# EAGLE design pepper-8m (EAGLE 6.4)
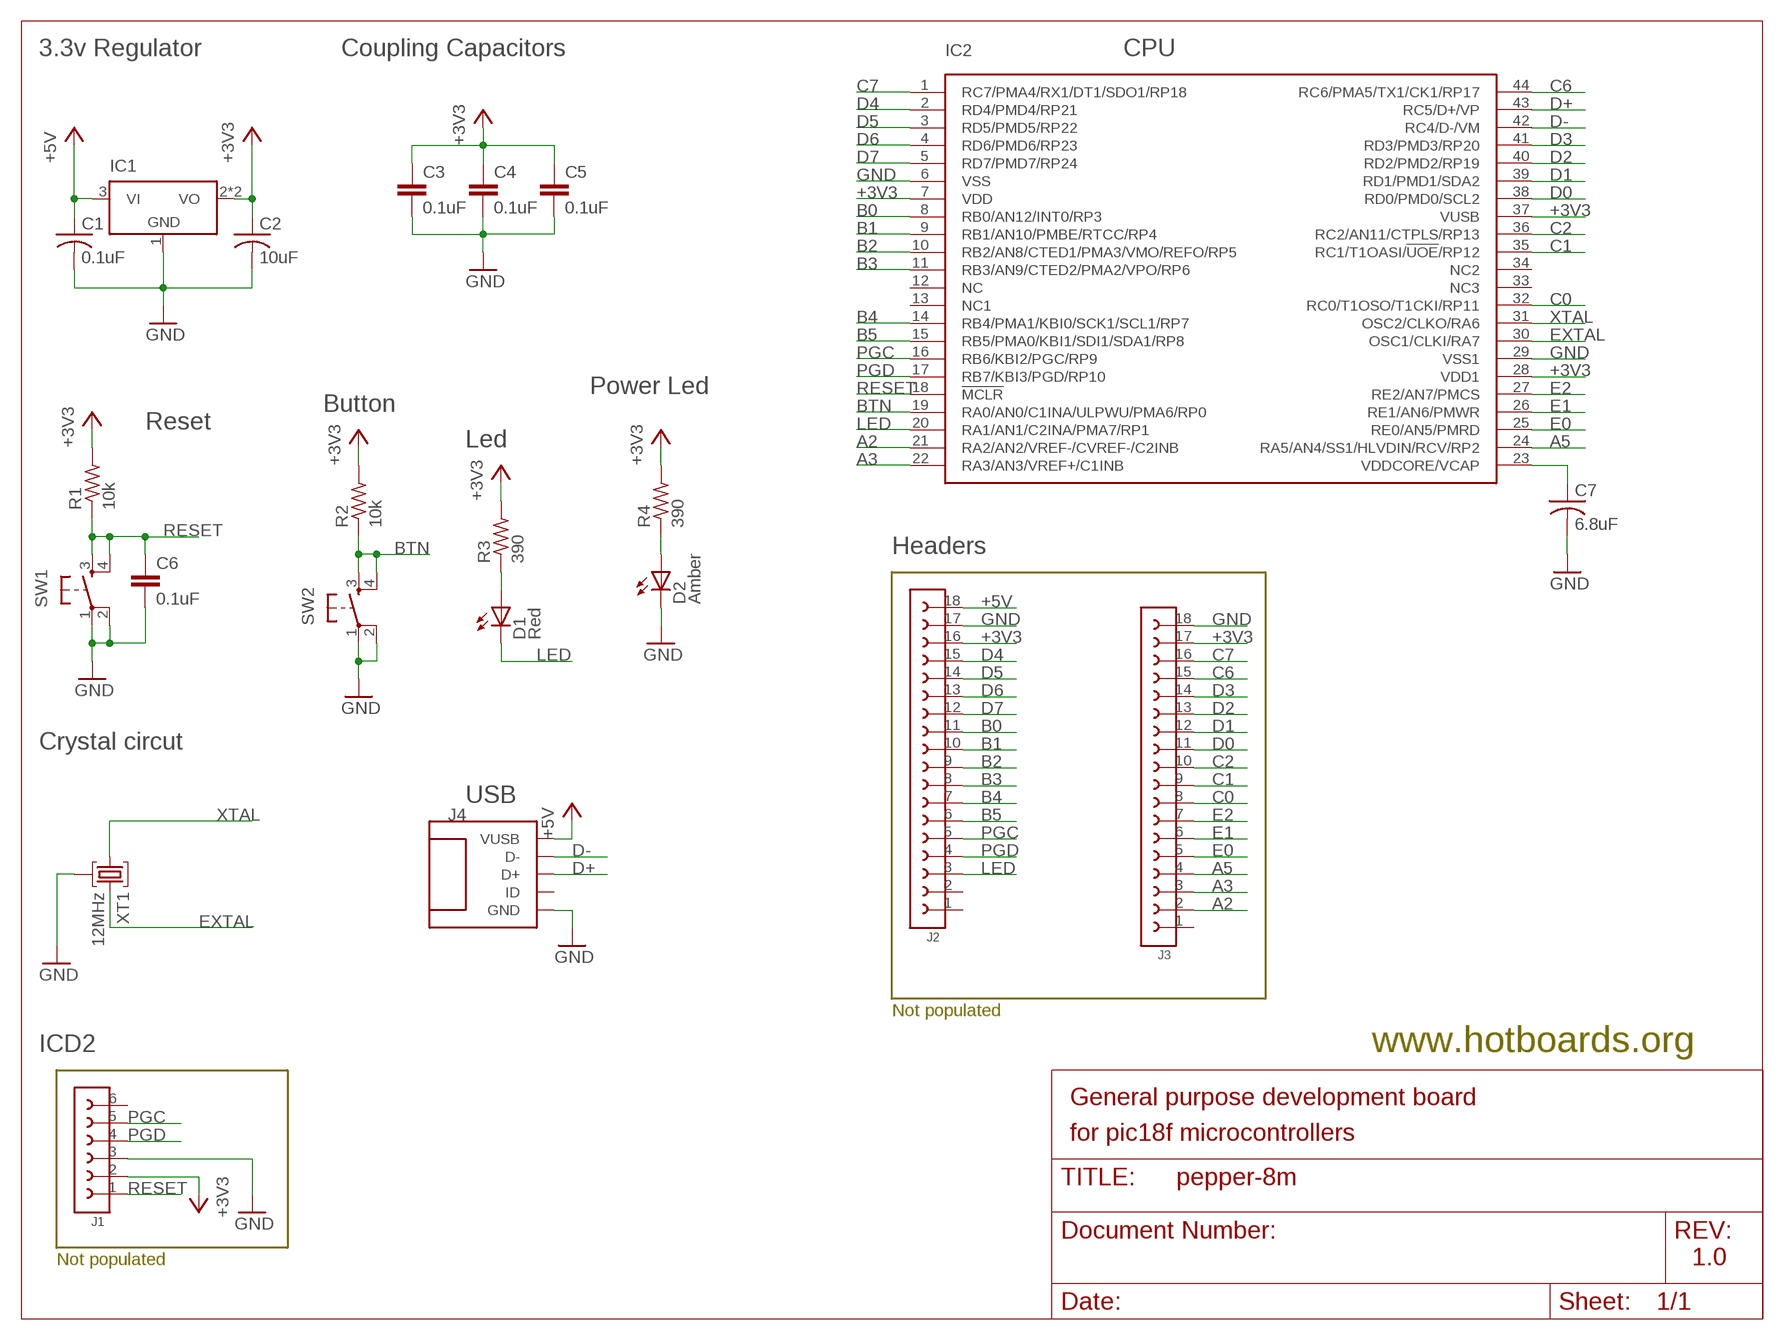
[diagram p0: schematic, sheet 1]

## Parts
C1  0.1uF  T491A104K050AT  [CAPMP3216-18]
C2  10uF  T491A106K016AT  [CAPMP3216-18]
C3  0.1uF  C0603C104Z3VAC  [CAPC0603]
C4  0.1uF  C0603C104Z3VAC  [CAPC0603]
C5  0.1uF  C0603C104Z3VAC  [CAPC0603]
C6  0.1uF  C0603C104Z3VAC  [CAPC0603]
C7  6.8uF  T491A685M006AT  [CAPMP3216-18]
D1  Red  SM0805AC  [D0805]
D2  Amber  SM0805HC  [D0805]
IC1  LD1117S33TR  [SOT230P700X180-4N]
IC2  PIC18F45J50-I/PT'  [TQFP80P1200X1200X100-44N]
J1  61300611121  [PHSP254P1524X254X1154-6S]
J2  61301811121  [PHSP254P4572X254X1154-18S]
J3  61301811121  [PHSP254P4572X254X1154-18S]
J4  -1734035-1  [USB-MINIB-SMD+SMD+RET]
R1  10k  CRG0603F10K10  [RESC0603]
R2  10k  CRG0603F10K10  [RESC0603]
R3  390  CRG0603F390R  [RESC0603]
R4  390  CRG0603F390R  [RESC0603]
SW1  TL3301NF160QJ  [TACT600X600-4J]
SW2  TL3301NF160QJ  [TACT600X600-4J]
XT1  12MHz  AWSCR-12.00CR-C  [CERAMIC460X200-3N]

## Nets
+3V3: C2.1 C3.1 C4.1 C5.1 IC1.2(VO) IC1.4(VO) IC2.7(VDD) IC2.28(VDD1) IC2.37(VUSB) J1.2 J2.16 J3.17 R1.P$2 R2.P$2 R3.P$2 R4.P$2
+5V: C1.1 IC1.3(VI) J2.18 J4.1(VUSB)
A2: IC2.21(RA2/AN2/VREF-/CVREF-/C2INB) J3.2
A3: IC2.22(RA3/AN3/VREF+/C1INB) J3.3
A5: IC2.24(RA5/AN4/SS1/HLVDIN/RCV/RP2) J3.4
B0: IC2.8(RB0/AN12/INT0/RP3) J2.11
B1: IC2.9(RB1/AN10/PMBE/RTCC/RP4) J2.10
B2: IC2.10(RB2/AN8/CTED1/PMA3/VMO/REFO/RP5) J2.9
B3: IC2.11(RB3/AN9/CTED2/PMA2/VPO/RP6) J2.8
B4: IC2.14(RB4/PMA1/KBI0/SCK1/SCL1/RP7) J2.7
B5: IC2.15(RB5/PMA0/KBI1/SDI1/SDA1/RP8) J2.6
BTN: IC2.19(RA0/AN0/C1INA/ULPWU/PMA6/RP0) R2.P$1 SW2.3(S) SW2.4(S1)
C0: IC2.32(RC0/T1OSO/T1CKI/RP11) J3.8
C1: IC2.35(RC1/T1OASI/!UOE!/RP12) J3.9
C2: IC2.36(RC2/AN11/CTPLS/RP13) J3.10
C6: IC2.44(RC6/PMA5/TX1/CK1/RP17) J3.15
C7: IC2.1(RC7/PMA4/RX1/DT1/SDO1/RP18) J3.16
D0: IC2.38(RD0/PMD0/SCL2) J3.11
D1: IC2.39(RD1/PMD1/SDA2) J3.12
D2: IC2.40(RD2/PMD2/RP19) J3.13
D3: IC2.41(RD3/PMD3/RP20) J3.14
D4: IC2.2(RD4/PMD4/RP21) J2.15
D5: IC2.3(RD5/PMD5/RP22) J2.14
D6: IC2.4(RD6/PMD6/RP23) J2.13
D7: IC2.5(RD7/PMD7/RP24) J2.12
D+: IC2.43(RC5/D+/VP) J4.3(D+)
D-: IC2.42(RC4/D-/VM) J4.2(D-)
E0: IC2.25(RE0/AN5/PMRD) J3.5
E1: IC2.26(RE1/AN6/PMWR) J3.6
E2: IC2.27(RE2/AN7/PMCS) J3.7
EXTAL: IC2.30(OSC1/CLKI/RA7) XT1.3
GND: C1.2 C2.2 C3.2 C4.2 C5.2 C6.2 C7.2 D2.2(C) IC1.1(GND) IC2.6(VSS) IC2.29(VSS1) J1.3 J2.17 J3.18 J4.5(GND) SW1.1(P) SW1.2(P1) SW2.1(P) SW2.2(P1) XT1.2
LED: D1.2(C) IC2.20(RA1/AN1/C2INA/PMA7/RP1) J2.3
N$1: D1.1(A) R3.P$1
N$2: C7.1 IC2.23(VDDCORE/VCAP)
N$3: D2.1(A) R4.P$1
PGC: IC2.16(RB6/KBI2/PGC/RP9) J1.5 J2.5
PGD: IC2.17(RB7/KBI3/PGD/RP10) J1.4 J2.4
RESET: C6.1 IC2.18(!MCLR) J1.1 R1.P$1 SW1.3(S) SW1.4(S1)
XTAL: IC2.31(OSC2/CLKO/RA6) XT1.1
Unconnected: IC2.12(NC) IC2.13(NC1) IC2.33(NC3) IC2.34(NC2) J1.6 J2.1 J2.2 J3.1 J4.4(ID)

## Notes on the sheet
- 3.3v Regulator | Coupling Capacitors | CPU
- Power Led
- Button
- Reset
- Led
- Headers
- Crystal circut
- USB
- Not populated
- ICD2 | www.hotboards.org
- General purpose development board
- for pic18f microcontrollers
- Not populated | 1.0

## Library data of the parts
C1 = kemet-capacitors-tantalum:T491?*: T491 Industrial Grade MnO2 Series Description OVERVIEW The KEMET T491 Series, designed speciﬁ cally for today’s highly automated surface mount processes and equipment, is the leading choice for surface mount designs. The T491 combines KEMET’s proven solid tantalum technology, acclaimed and respected throughout the world, with the latest in materials, processes and automation, resulting in unsurpassed total performance and value APPLICATIONS Typical applications include decoupling and ﬁ ltering in industrial and automotive end applications such as DC/DC converters, portable electronics, telecommunications, and control units. BENEFITS: • Taped and reeled per EIA 481–1 • Symmetrical, compliant terminations • Optical gold-plated terminations • Laser-marked case • 100% surge current test on C, D, E, U, V, X sizes • Halogen free epoxy • Capacitance 0.1 µF to 1,000 µF • Tolerance ±10%, ±20% • Voltage 2.5 – 50 VDC • Extended range values • Low proﬁ le case sizes • RoHS Compliant and lead-free terminations (See www.kemet.com for transition information) • Operating temperature: -55ºC to +125ºC How to Order T 491 X 157 K 020 A T Capacitor Class Series Case Size Capacitance Code (pF) Capacitance Tolerance Voltage Failure Rate/ Design Lead Material Packaging (C-Spec) T = Tantalum Industrial A, B, C, D, E, R, S, T, U, V, X First two digits represent signiﬁ cant ﬁgures. Third digit speciﬁ es number of zeros. K = ±10% M = ±20% 2R5 = 2.5 V 003 = 3 V 004 = 4 V 006 = 6.3 V 010 = 10 V 016 = 16 V 020 = 20 V 025 = 25 V 035 = 35 V 050 = 50 V A = N/A T = 100% Matte Tin (Sn) Plated* H = Standard Solder Coated (SnPb 5% Pb minimum) G = Gold Plated (A, B, C, D, X only) N = Non-Magnetic 100% Tin (Sn) M = Non-Magnetic (SnPb) Blank = 7" Reel 7280 = 13" Ree Ref: Datasheet <http://www.kemet.com/kemet/web/homepage/kechome.nsf/weben/9F2DE33590D9247E8525788D0059B1E1/$file/KEM_TC101_STD.pdf> Add more variants to T491@, just remplace the "@" with a new technologie named according to order code parameters. It is mandatory to fill up the following attributes MANUFACTURER, DESCRIPTION, MOUSER, AVNET, ARROW, FUTURE, NEWARK, DIGIKEY, AVRG-PRICE, OCTOPART-LINK, DATASHEET; AVRG-PRICE: 0.23; DATASHEET: http://www.kemet.com/kemet/web/homepage/kechome.nsf/weben/9F2DE33590D9247E8525788D0059B1E1/$file/KEM_TC101_STD.pdf; DESCRIPTION: Capacitores de tantalio - SMD sólido 50V 0.1uF 10% "A"; DIGIKEY: 399-8263-2-ND; EAGLEUP: CAPMP3216-18; MANUFACTURER: KEMET; MOUSER: 80-T491A104K050; NEWARK: 57K1620; OCTOPART-LINK: http://octopart.com/t491a104k050at-kemet-104789
C2 = kemet-capacitors-tantalum:T491?*: T491 Industrial Grade MnO2 Series Description OVERVIEW The KEMET T491 Series, designed speciﬁ cally for today’s highly automated surface mount processes and equipment, is the leading choice for surface mount designs. The T491 combines KEMET’s proven solid tantalum technology, acclaimed and respected throughout the world, with the latest in materials, processes and automation, resulting in unsurpassed total performance and value APPLICATIONS Typical applications include decoupling and ﬁ ltering in industrial and automotive end applications such as DC/DC converters, portable electronics, telecommunications, and control units. BENEFITS: • Taped and reeled per EIA 481–1 • Symmetrical, compliant terminations • Optical gold-plated terminations • Laser-marked case • 100% surge current test on C, D, E, U, V, X sizes • Halogen free epoxy • Capacitance 0.1 µF to 1,000 µF • Tolerance ±10%, ±20% • Voltage 2.5 – 50 VDC • Extended range values • Low proﬁ le case sizes • RoHS Compliant and lead-free terminations (See www.kemet.com for transition information) • Operating temperature: -55ºC to +125ºC How to Order T 491 X 157 K 020 A T Capacitor Class Series Case Size Capacitance Code (pF) Capacitance Tolerance Voltage Failure Rate/ Design Lead Material Packaging (C-Spec) T = Tantalum Industrial A, B, C, D, E, R, S, T, U, V, X First two digits represent signiﬁ cant ﬁgures. Third digit speciﬁ es number of zeros. K = ±10% M = ±20% 2R5 = 2.5 V 003 = 3 V 004 = 4 V 006 = 6.3 V 010 = 10 V 016 = 16 V 020 = 20 V 025 = 25 V 035 = 35 V 050 = 50 V A = N/A T = 100% Matte Tin (Sn) Plated* H = Standard Solder Coated (SnPb 5% Pb minimum) G = Gold Plated (A, B, C, D, X only) N = Non-Magnetic 100% Tin (Sn) M = Non-Magnetic (SnPb) Blank = 7" Reel 7280 = 13" Ree Ref: Datasheet <http://www.kemet.com/kemet/web/homepage/kechome.nsf/weben/9F2DE33590D9247E8525788D0059B1E1/$file/KEM_TC101_STD.pdf> Add more variants to T491@, just remplace the "@" with a new technologie named according to order code parameters. It is mandatory to fill up the following attributes MANUFACTURER, DESCRIPTION, MOUSER, AVNET, ARROW, FUTURE, NEWARK, DIGIKEY, AVRG-PRICE, OCTOPART-LINK, DATASHEET; AVRG-PRICE: 0.18; DATASHEET: http://www.kemet.com/kemet/web/homepage/kechome.nsf/weben/9F2DE33590D9247E8525788D0059B1E1/$file/KEM_TC101_STD.pdf; DESCRIPTION: Capacitores de tantalio - SMD sólido 16volt 10uF 10% Lead Free; DIGIKEY: 399-8269-2-ND; EAGLEUP: CAPMP3216-18; MANUFACTURER: KEMET; MOUSER: 80-T491A106K016; OCTOPART-LINK: http://octopart.com/t491a106k016at-kemet-145880
C3-C6 = kemet-capacitors-ceramic:C?C*VAC: Y5V Dielectric, 6.3 – 50 VDC (Commercial Grade) Description OVERVIEW: KEMET’s Y5V dielectric features an 85°C maximum operating temperature and is considered “general-purpose.” The Electronics Components, Assemblies & Materials Association (EIA) characterizes Z5U dielectric as a Class III material. Components of this classiﬁ cation are ﬁ xed, ceramic dielectric capacitors suited for bypass and decoupling or other applications in which dielectric losses, high insulation resistance and capacitance stability are not of major importance. Y5V exhibits a predictable change in capacitance with respect to time and voltage and displays wide variations in capacitance with reference to ambient temperature. Capacitance change is limited to +22%, -82% from -30°C to +85°C. APPLICATIONS: Typical applications include limited temperature, decoupling and bypass. BENEFITS • -30°C to +85°C operating temperature range • Pb-Free and RoHS Compliant • EIA 0402, 0603, 0805, 1206, and 1210 case sizes • DC voltage ratings of 6.3 V, 10 V, 16 V, 25 V, and 50 V • Capacitance offerings ranging from 0.022 μF to 22 μF • Available capacitance tolerance of +80%/ -20% • Non-polar device, minimizing installation concerns • 100% pure matte tin-plated termination ﬁ nish that allowing for excellent solderability How to Order C 1210 C 226 Z 4 V A C TU Capacitor Class Case Size Specification Series Capacitance Code (pF) Capacitance Tolerance Voltage Dielectric Failure Rate/Design Termination Finish Packaging Grade C = Ceramic 0402 0603 0805 1206 1210 C = Standart 2 signiﬁ cant digits + number of zeros. Use 9 for 1.0 – 9.9 pF Use 8 for 0.5 – .99 pF e.g., 2.2 pF = 229 e.g., 0.5 pF = 508 Z = +80%/-20% 9 = 6.3V 8 = 10V 4 = 16V 3 = 25V 5 = 50 V V = Y5V A = N/A A = 100% Matte Blank = Bulk TU = 7" Reel Unmarked. Ref: Datasheet <http://www.kemet.com/kemet/web/homepage/kechome.nsf/weben/B79D94FAACCDEFCE852579F10063745E/$file/KEM_CC101_COMM_SMD.pdf> Add more variants to C@VAC, just remplace the "@" with a new technologie named according to order code parameters. It is mandatory to fill up the following attributes MANUFACTURER, DESCRIPTION, MOUSER, AVNET, ARROW, FUTURE, NEWARK, DIGIKEY, AVRG-PRICE, OCTOPART-LINK, DATASHEET; AVNET: C0603C104Z3VAC TU; AVRG-PRICE: 0.1; DATASHEET: http://www.kemet.com/kemet/web/homepage/kechome.nsf/weben/B79D94FAACCDEFCE852579F10063745E/$file/KEM_CC101_COMM_SMD.pdf; DESCRIPTION: Capacitores cerámicos de capas múltiples (MLCC) - SMD/SMT0603 25volts 0.1uF Y5V -20+80%; DIGIKEY: 399-1100-2-ND; EAGLEUP: CAPC0603; MANUFACTURER: KEMET; MOUSER: 80-C0603C104Z3V; NEWARK: 31C9013; OCTOPART-LINK: http://octopart.com/c0603c104z3vactu-kemet-98662
C7 = kemet-capacitors-tantalum:T491?*: T491 Industrial Grade MnO2 Series Description OVERVIEW The KEMET T491 Series, designed speciﬁ cally for today’s highly automated surface mount processes and equipment, is the leading choice for surface mount designs. The T491 combines KEMET’s proven solid tantalum technology, acclaimed and respected throughout the world, with the latest in materials, processes and automation, resulting in unsurpassed total performance and value APPLICATIONS Typical applications include decoupling and ﬁ ltering in industrial and automotive end applications such as DC/DC converters, portable electronics, telecommunications, and control units. BENEFITS: • Taped and reeled per EIA 481–1 • Symmetrical, compliant terminations • Optical gold-plated terminations • Laser-marked case • 100% surge current test on C, D, E, U, V, X sizes • Halogen free epoxy • Capacitance 0.1 µF to 1,000 µF • Tolerance ±10%, ±20% • Voltage 2.5 – 50 VDC • Extended range values • Low proﬁ le case sizes • RoHS Compliant and lead-free terminations (See www.kemet.com for transition information) • Operating temperature: -55ºC to +125ºC How to Order T 491 X 157 K 020 A T Capacitor Class Series Case Size Capacitance Code (pF) Capacitance Tolerance Voltage Failure Rate/ Design Lead Material Packaging (C-Spec) T = Tantalum Industrial A, B, C, D, E, R, S, T, U, V, X First two digits represent signiﬁ cant ﬁgures. Third digit speciﬁ es number of zeros. K = ±10% M = ±20% 2R5 = 2.5 V 003 = 3 V 004 = 4 V 006 = 6.3 V 010 = 10 V 016 = 16 V 020 = 20 V 025 = 25 V 035 = 35 V 050 = 50 V A = N/A T = 100% Matte Tin (Sn) Plated* H = Standard Solder Coated (SnPb 5% Pb minimum) G = Gold Plated (A, B, C, D, X only) N = Non-Magnetic 100% Tin (Sn) M = Non-Magnetic (SnPb) Blank = 7" Reel 7280 = 13" Ree Ref: Datasheet <http://www.kemet.com/kemet/web/homepage/kechome.nsf/weben/9F2DE33590D9247E8525788D0059B1E1/$file/KEM_TC101_STD.pdf> Add more variants to T491@, just remplace the "@" with a new technologie named according to order code parameters. It is mandatory to fill up the following attributes MANUFACTURER, DESCRIPTION, MOUSER, AVNET, ARROW, FUTURE, NEWARK, DIGIKEY, AVRG-PRICE, OCTOPART-LINK, DATASHEET; AVRG-PRICE: 0.18; DATASHEET: http://www.kemet.com/kemet/web/homepage/kechome.nsf/weben/9F2DE33590D9247E8525788D0059B1E1/$file/KEM_TC101_STD.pdf; DESCRIPTION: Capacitores de tantalio - SMD sólido 6.3volts 6.8uF 20% A; DIGIKEY: 399-10133-2-ND; EAGLEUP: CAPMP3216-18; MANUFACTURER: KEMET; MOUSER: 80-T491A685M006; NEWARK: 40K0311; OCTOPART-LINK: http://octopart.com/t491a685m006at-kemet-967879
D1 = bivar-smleds:SM0805*: Surface Mount LED 0805 Description Bivar Surface Mount 0805 package LED may be used in nearly any lighting or indication application. The miniature package is ideal for small scale applications such as general indication and backlighting. Low power consumption and excellent long life reliability are suitable for battery powered equipment. Bivar offers water clear LED lens for maximum luminous intensity. Wide variety of wavelength and intensity combinations are available to meet any illumination need. The SM0805 LED is packaged in standard tape and reels for pick and place assemblies. ♦ Industry Standard 0805 Package ♦ RoHS Compliant ♦ Small Package and Footprint ♦ Water Clear Lens ♦ Wide Viewing Angle ♦ Ideal for Status Indication, Display, and Backlighting How to Order Type Package Color Clear type Current level SM = Surface mount 0805 A = Amber BW = Blue G = Green H = HE red O = Orange PG = Pure Green R = Read SB = Super Blue SG = Super Green SPG = Super Pure Green SR = Super Red UBW = Ultra Blue UH = Ultra HE Red UO = Ultra Orange UPG = Ultra Pure Green UR = Ultra Red UW = Ultra White UY = Ultra Yellow XPG = Xtra Pure Green Y = Yellow C = Water Clear None = standart L = Low Current Ref: Link <http://www.bivar.com/Products/LEDIndication/LEDs/SurfaceMountLEDs.aspx> Add more variants to SM0805@, just remplace the "@" with a new technologie named according to order code parameters. It is mandatory to fill up the following attributes DESCRIPTION, MOUSER, AVNET, ARROW, FUTURE, NEWARK, DIGIKEY, AVRG-PRICE, OCTOPART-LINK, DATASHEET; AVRG-PRICE: 0.4; DATASHEET: http://www.bivar.com/Images/Cart/SM0805AC.pdf; DESCRIPTION: LED, SMD, 0805, 2 Leads, Amber, Water Clear Lens, 130 Deg Viewing Angle; DIGIKEY: SM0805AC-ND; EAGLEUP: D0805; MOUSER: 749-SM0805AC; NEWARK: 20K3100; OCTOPART-LINK: http://octopart.com/sm0805ac-bivar-5838577
D2 = bivar-smleds:SM0805*: Surface Mount LED 0805 Description Bivar Surface Mount 0805 package LED may be used in nearly any lighting or indication application. The miniature package is ideal for small scale applications such as general indication and backlighting. Low power consumption and excellent long life reliability are suitable for battery powered equipment. Bivar offers water clear LED lens for maximum luminous intensity. Wide variety of wavelength and intensity combinations are available to meet any illumination need. The SM0805 LED is packaged in standard tape and reels for pick and place assemblies. ♦ Industry Standard 0805 Package ♦ RoHS Compliant ♦ Small Package and Footprint ♦ Water Clear Lens ♦ Wide Viewing Angle ♦ Ideal for Status Indication, Display, and Backlighting How to Order Type Package Color Clear type Current level SM = Surface mount 0805 A = Amber BW = Blue G = Green H = HE red O = Orange PG = Pure Green R = Read SB = Super Blue SG = Super Green SPG = Super Pure Green SR = Super Red UBW = Ultra Blue UH = Ultra HE Red UO = Ultra Orange UPG = Ultra Pure Green UR = Ultra Red UW = Ultra White UY = Ultra Yellow XPG = Xtra Pure Green Y = Yellow C = Water Clear None = standart L = Low Current Ref: Link <http://www.bivar.com/Products/LEDIndication/LEDs/SurfaceMountLEDs.aspx> Add more variants to SM0805@, just remplace the "@" with a new technologie named according to order code parameters. It is mandatory to fill up the following attributes DESCRIPTION, MOUSER, AVNET, ARROW, FUTURE, NEWARK, DIGIKEY, AVRG-PRICE, OCTOPART-LINK, DATASHEET; AVRG-PRICE: 0.4; DATASHEET: http://www.bivar.com/images/cart/SM0805HC.pdf; DESCRIPTION: LED estándar - SMD (montaje superficial) HE Red 660 nm Water Clear; DIGIKEY: SM0805HC-ND; EAGLEUP: D0805; MOUSER: 749-SM0805HC; OCTOPART-LINK: http://octopart.com/sm0805hc-bivar-2191580
IC1 = st-ldos:LD1117?*: Low Drop Adjustable Positive Voltage Regulator Description The LD1117 is a low drop voltage regulator able to provide up to 800 mA of output current, available even in adjustable version (VREF= 1.25 V). Concerning fixed versions, are offered the following output voltages: 1.2 V, 1.8 V, 2.5 V, 2.85 V, 3.3 V and 5.0 V. The 2.85 V type is ideal for SCSI-2 lines active termination. The device is supplied in: SOT-223, DPAK, SO-8 and TO-220. The SOT-223 and DPAK surface mount packages optimize the thermal characteristics even offering a relevant space saving effect. High efficiency is assured by NPN pass transistor. In fact in this case, unlike than PNP one, the quiescent current flows mostly into the load. Only a very common 10 μF minimum capacitor is needed for stability. On chip trimming allows the regulator to reach a very tight output voltage tolerance, within ± 1 % at 25 °C. The adjustable LD1117 is pin to pin compatible with the other standard. Adjustable voltage regulators maintaining the better performances in terms of drop and tolerance. KEY FEATURES Low dropout voltage (1 V typ.) 2.85 V device performances are suitable for SCSI-2 active termination Output current up to 800 mA Fixed output voltage of: 1.2 V, 1.8 V, 2.5 V, 3.3 V, 5.0 V Adjustable version availability (VREF= 1.25 V) Internal current and thermal limit Available in ± 1 % (at 25 °C) and 2 % in full temperature range Supply voltage rejection: 75 dB (typ.) How To Order Part Number Package Output Voltaje Temp Range LD1117 S = SOT-223 D = SOIC8 DT = DPACK V = TO220 None = Adjustable 12 = 1.2 volts 18 = 1.8 volts 25 = 2.5 volts 33 = 3.3 volts 50 = 5.0 volts None = 0 to 125 C C = -40 to 125 C Ref: Datasheet <http://www.st.com/internet/com/TECHNICAL_RESOURCES/TECHNICAL_LITERATURE/DATASHEET/CD00000544.pdf> Add more variants to LD1117@, just remplace the "@" with a new technologie named according to order code parameters. It is mandatory to fill up the following attributes MANUFACTURER, DESCRIPTION, MOUSER, AVNET, ARROW, FUTURE, NEWARK, DIGIKEY, AVRG-PRICE, OCTOPART-LINK, DATASHEET; ARROW: LD1117S33TR; AVNET: LD1117S33TR; AVRG-PRICE: 0.76; DATASHEET: http://www.st.com/internet/com/TECHNICAL_RESOURCES/TECHNICAL_LITERATURE/DATASHEET/CD00000544.pdf; DESCRIPTION: Reguladores de interrupción de nivel bajo - LDO 3.3V 0.8A Positive; DIGIKEY: 497-1242-2-ND; EAGLEUP: SOT230P700X180-4N; FUTURE: LD1117S33TR; MANUFACTURER: ST; MOUSER: 511-LD1117S33; NEWARK: 89K0627; OCTOPART-LINK: http://octopart.com/ld1117s33tr-stmicroelectronics-526708
IC2 = mchp-pic18:PIC18F4*J50-I/PT: 44 pins USB microcontroller from 16k to 64k flash and 4k Ram Description PIC18F44J50 (16K Flash, 3776 bytes RAM) PIC18F45J50 (32K Flash, 3776 bytes RAM) PIC18F46J50 (64K Flash, 3776 bytes RAM) Power Management Features with nanoWatt XLP™ for Extreme Low-Power: • Deep Sleep mode: CPU off, Peripherals off, Currents Down to 13 nA and 850 nA with RTCC: - Able to wake-up on external triggers, programmable WDT or RTCC alarm - Ultra Low-Power Wake-up (ULPWU) • Sleep mode: CPU off, Peripherals off, SRAM on, Fast Wake-up, Currents Down to 105 nA, Typical • Idle: CPU off, Peripherals on, Currents Down to 2.3 A, Typical • Run: CPU on, Peripherals on, Currents Down to 6.2 A, Typical • Timer1 Oscillator w/RTCC: 1 A, 32 kHz, Typical • Watchdog Timer: 0.8 µA, 2V, Typical Special Microcontroller Features: • Low-Power, High-Speed CMOS Flash Technology • C Compiler Optimized Architecture for Re-Entrant Code • Priority Levels for Interrupts • Self-Programmable under Software Control • 8 x 8 Single-Cycle Hardware Multiplier • Extended Watchdog Timer (WDT): - Programmable period from 4 ms to 131s • Single-Supply In-Circuit Serial Programming™ (ICSP™) via two pins • In-Circuit Debug (ICD) w/Three Breakpoints via 2 Pins • Operating Voltage Range of 2.0V to 3.6V • On-Chip 2.5V Regulator • Flash Program Memory of 10,000 Erase/Write Cycles Minimum and 20-Year Data Retention Universal Serial Bus (USB) Features • USB V2.0 Compliant • Full Speed (12 Mbps) and Low Speed (1.5 Mbps) • Supports Control, Interrupt, Isochronous and B ulk Transfers • Supports up to 32 Endpoints (16 bidirectional) • USB module can use any RAM Location on the Device as USB Endpoint Buffers • On-Chip USB Transceiver with Crystal-less operation Flexible Oscillator Structure: • High-Precision Internal Oscillator (±0.15% typ.) for USB • Two External Clock modes, up to 48 MHz (12 MIPS) • Low-Power, 31 kHz Internal RC Oscillator • Tunable Internal Oscillator (31 kHz to 8 MHz, or up to 48 MHz with PLL) • Secondary Oscillator using Timer1 @ 32 kHz • Fail-Safe Clock Monitor: - Allows for safe shutdown if any clock stops • Two-Speed Oscillator Start-up • Programmable Reference Clock Output Generator Ref: Datasheets <http://ww1.microchip.com/downloads/en/DeviceDoc/39931d.pdf>; AVRG-PRICE: 3.19; DATASHEET: http://ww1.microchip.com/downloads/en/DeviceDoc/39931d.pdf; DESCRIPTION: Microcontroladores de 8 bits - MCU Full Spd USB 32KB 4KBRAM nanoWatt; DIGIKEY: PIC18F45J50-I/PT-ND; EAGLEUP: QFP80P1200X1200X100-44N; MANUFACTURER: MICROCHIP; MOUSER: 579-PIC18F45J50-I/PT; NEWARK: 98M1823; OCTOPART-LINK: http://octopart.com/pic18f45j50-i%2Fpt-microchip-12185033
J1 = wurth-pin-socket-headers:6130061?: (6) 2.54mm Pin Header Description MATERIAL INSULATOR: PBT FLAMABILITY RATING: UL94-V0 COLOR: BLACK CONTACT MATERIAL: COPPER ALLOY CONTACT TYPE: STAMPED CONTACT PLATING: GOLD QUALITY CLASS: 3 AS PER CECC 75 301-802 PITCH: 2.54MM ENVIRONMENTAL OPERATING TEMPERATURE: -40 UP TO 125°C COMPLIANCE: LEAD FREE AND ROHS ELECTRICAL CURRENT RATING: 3A WORKING VOLTAGE: 250V AC INSULATOR RESISTANCE: >1000 MOHM DIELECTRIC WITHSTANDING VOLTAGE: 500V AC/MN CONTACT RESISTANCE: 20 mOHM MAX DIMENSION B = 2.54 x NB POSITIONS How to order Type Header/Socket Number of Positions Variation 613 = 2.54mm Pitch from 1 to 40 1121 = Pin Header Straigh Post 1021 = Pin Header Right Angle 1821 = Socket Header Straigh Post 43121 = Socket Header Right Angle Ref: Datasheet <http://katalog.we-online.de/em/datasheet/6130xx11121.pdf> , Datasheet <http://katalog.we-online.de/em/datasheet/6130xx11021.pdf> , Datasheet <http://katalog.we-online.de/em/datasheet/6130xx11821.pdf> , Datasheet <http://katalog.we-online.de/em/datasheet/6130xx143121.pdf>; AVRG-PRICE: 0.41; DATASHEET: http://www.mouser.com/ds/2/445/6130xx11121-48870.pdf; DESCRIPTION: pin header straight post 2.54"; EAGLEUP: PHSP254P1524X254X1154-6S; MANUFACTURER: WURTH; MOUSER: 710-61300611121; OCTOPART-LINK: http://octopart.com/61300611121-w%C3%BCrth+elektronik+midcom-20084590
J2 J3 = wurth-pin-socket-headers:6130181?: (18) 2.54mm Pin Header Description MATERIAL INSULATOR: PBT FLAMABILITY RATING: UL94-V0 COLOR: BLACK CONTACT MATERIAL: COPPER ALLOY CONTACT TYPE: STAMPED CONTACT PLATING: GOLD QUALITY CLASS: 3 AS PER CECC 75 301-802 PITCH: 2.54MM ENVIRONMENTAL OPERATING TEMPERATURE: -40 UP TO 125°C COMPLIANCE: LEAD FREE AND ROHS ELECTRICAL CURRENT RATING: 3A WORKING VOLTAGE: 250V AC INSULATOR RESISTANCE: >1000 MOHM DIELECTRIC WITHSTANDING VOLTAGE: 500V AC/MN CONTACT RESISTANCE: 20 mOHM MAX DIMENSION B = 2.54 x NB POSITIONS How to order Type Header/Socket Number of Positions Variation 613 = 2.54mm Pitch from 1 to 40 1121 = Pin Header Straigh Post 1021 = Pin Header Right Angle 1821 = Socket Header Straigh Post 43121 = Socket Header Right Angle Ref: Datasheet <http://katalog.we-online.de/em/datasheet/6130xx11121.pdf> , Datasheet <http://katalog.we-online.de/em/datasheet/6130xx11021.pdf> , Datasheet <http://katalog.we-online.de/em/datasheet/6130xx11821.pdf> , Datasheet <http://katalog.we-online.de/em/datasheet/6130xx143121.pdf>; EAGLEUP: PHSP254P4572X254X1154-18S
J4 = te-usb:?-1734035-1: USB MINIB R/A RCPT Description Product Type Features: Size = Mini Series = B Gender = Receptacle Orientation = Right Angle LED = Without PCB Mount Retention Type = SMT Hold Down Mechanical Attachment: Mount Location = Top Termination Features: Contact Termination Type = Surface Mount Termination Method = Solder Dimensions: PCB Thickness, Recommended (mm [in]) = 1.57 [0.062] How to order Common Part Type = Caractericitcs 1734035-1 = With retentive legs 1- = without retentive legs Ref: Datasheet <http://www.te.com/commerce/DocumentDelivery/DDEController?Action=showdoc&DocId=Customer+Drawing%7F1734035%7FE%7Fpdf%7FEnglish%7FENG_CD_1734035_E.pdf%7F1-1734035-2>; EAGLEUP: USB-MINIB-SMD+SMD+RET
R1 R2 = te-fixed-resistors:CRG?*: Thick Film Chip Resistors 1% and 5% tolerance Description Precious metal terminations are screen printed onto a ceramic base and fired. The resistive element is screen printed and fired and the passivation layer added. Each resistor is trimmed to tolerance by laser. The pre-scribed tile is broken into strips, the end plating is fired on and the strips broken into individual components. Final termination is made by electroplating. Key Features Thick film resistors with a high power to size ratio,ideally suited to industrial and general purpose use. A range from 1 ohm to 10M and tolerances of 1% and 5%. Also including zero ohm links. Suitable for most applications, including high frequency operation, owing to the short lead structure and low capacitance. Seven Package Sizes Terminal finish: Matte Sn MSL Level 2 How to order Common Part Size Tolerance Resistance Value CRG - Thick Film Chip Resistor 0201 0402 0603 0805 1206 2512 F - ±1% J - ±5% 1 ohm (1 ohm) 1R0 1K ohm (1000 ohms) 1K 100K ohm (100000 ohms) 100K 1M ohm (1000000 ohms) 1M Ref: Datasheet <http://www.te.com/commerce/DocumentDelivery/DDEController?Action=showdoc&DocId=Data+Sheet%7F1773204%7FH%7Fpdf%7FEnglish%7FENG_DS_1773204_H.pdf%7F1623095-1>; AVRG-PRICE: 0.1; DATASHEET: http://www.te.com/commerce/DocumentDelivery/DDEController?Action=showdoc&DocId=Data+Sheet%7F1773204%7FH%7Fpdf%7FEnglish%7FENG_DS_1773204_H.pdf%7F1623095-1; DESCRIPTION: Resistores de película gruesa - SMD CRG0603 1% 10K 10KRL; EAGLEUP: RESC0603; MOUSER: 279-CRG0603F10K/10; OCTOPART-LINK: http://octopart.com/crg0603f10k10-tyco+electronics-16077289
R3 R4 = te-fixed-resistors:CRG?*: Thick Film Chip Resistors 1% and 5% tolerance Description Precious metal terminations are screen printed onto a ceramic base and fired. The resistive element is screen printed and fired and the passivation layer added. Each resistor is trimmed to tolerance by laser. The pre-scribed tile is broken into strips, the end plating is fired on and the strips broken into individual components. Final termination is made by electroplating. Key Features Thick film resistors with a high power to size ratio,ideally suited to industrial and general purpose use. A range from 1 ohm to 10M and tolerances of 1% and 5%. Also including zero ohm links. Suitable for most applications, including high frequency operation, owing to the short lead structure and low capacitance. Seven Package Sizes Terminal finish: Matte Sn MSL Level 2 How to order Common Part Size Tolerance Resistance Value CRG - Thick Film Chip Resistor 0201 0402 0603 0805 1206 2512 F - ±1% J - ±5% 1 ohm (1 ohm) 1R0 1K ohm (1000 ohms) 1K 100K ohm (100000 ohms) 100K 1M ohm (1000000 ohms) 1M Ref: Datasheet <http://www.te.com/commerce/DocumentDelivery/DDEController?Action=showdoc&DocId=Data+Sheet%7F1773204%7FH%7Fpdf%7FEnglish%7FENG_DS_1773204_H.pdf%7F1623095-1>; AVRG-PRICE: 0.1; DATASHEET: http://www.te.com/commerce/DocumentDelivery/DDEController?Action=showdoc&DocId=Data+Sheet%7F1773204%7FH%7Fpdf%7FEnglish%7FENG_DS_1773204_H.pdf%7F1623095-1; DESCRIPTION: Resistores de película gruesa - SMD 0603 390Ohms 1/10W 50V; EAGLEUP: RESC0603; MOUSER: 279-CRG0603F390R; OCTOPART-LINK: http://octopart.com/crg0603f390r-tyco+electronics-16077369
SW1 SW2 = esw-tactile-sw:TL3301?*J: 6mm x 6mm Push Button, J lead Description Designed for SMT applications, each model has different features ranging from low profile designs, normally opened, right angle, and dual action. Applications include telecommunications, consumer electronics, audio/visual, medical devices, testing/instrumentation and computer/peripherals. SPECIFICATIONS: RATING: 50mA 12VDC MECHANICAL LIFE: ≥100,000 Cycles CONTACT RESISTANCE: 100mΩ Max. INSULATION RESISTANCE: 100MΩ Min. DIELECTRIC STRENGTH: 250VAC ACTUATION FORCE: 100gf ± 50gf; 160gf± 50gf; 260gf ± 50gf How to order Series Model Actuator Operating Force Contact Material Termination TL 3301 N = 4.3mm A = 5.0mm E = 7.3mm F = 7.0mm C = 8.0mm P = 8.5mm B = 9.5mm D =13.0mm F100 F160 F260 R - Gold Q - Silver J - J-lead Ref: Datasheet <http://www.e-switch.com/Portals/0/Series_Pdf/TL3301.pdf> Add more variants to TL3301@J, just remplace the "@" with a new technologie named according to order code parameters. It is mandatory to fill up the following attributes MANUFACTURER, DESCRIPTION, MOUSER, AVNET, ARROW, FUTURE, NEWARK, DIGIKEY, AVRG-PRICE, OCTOPART-LINK, DATASHEET; AVRG-PRICE: 0.41; DATASHEET: http://www.e-switch.com/Portals/0/Series_Pdf/TL3301.pdf; DESCRIPTION: Interruptores táctiles SMT Tact Switch SPST-NO 0.05A 12V J; DIGIKEY: EG4376TR-ND; EAGLEUP: TACT600X600X430-4J; MANUFACTURER: E-SWITCH; MOUSER: 612-TL3301NF160QJ; NEWARK: 15N4501; OCTOPART-LINK: http://octopart.com/tl3301nf160qj-e-switch-1252925
XT1 = abracon-resonators:AWSCR-*CR-C: 4.5 x 2.0 x 1.2 mm INDUSTRIAL GRADE BUILT-IN CAPACITANCE CERAMIC RESONATOR Description FEATURES: • Low resonant impedance • Built-in load capacitors • IR reflow capable APPLICATIONS: • Remote controls, Microprocessor clocks, DVD & CD-ROMs, Electric appliances • Consumer electronics How to Order Cristal Frequency in MHz Load Capacitance Packaging AWSCR 12.00CR-C Contact ABRACON for Built-in Capacitance options Blank: Bulk T: Tape & Reel Ref: Datasheet <http://www.abracon.com/Resonators/AWSCR_MGD.pdf> Add more variants to AWSCR@, just remplace the "@" with a new technologie named according to order code parameters. It is mandatory to fill it up the following attributes MANUFACTURER, DESCRIPTION, MOUSER, AVNET, ARROW, FUTURE, NEWARK, DIGIKEY, AVRG-PRICE, OCTOPART-LINK, DATASHEET; MANUFACTURER: ABRACON

## Board
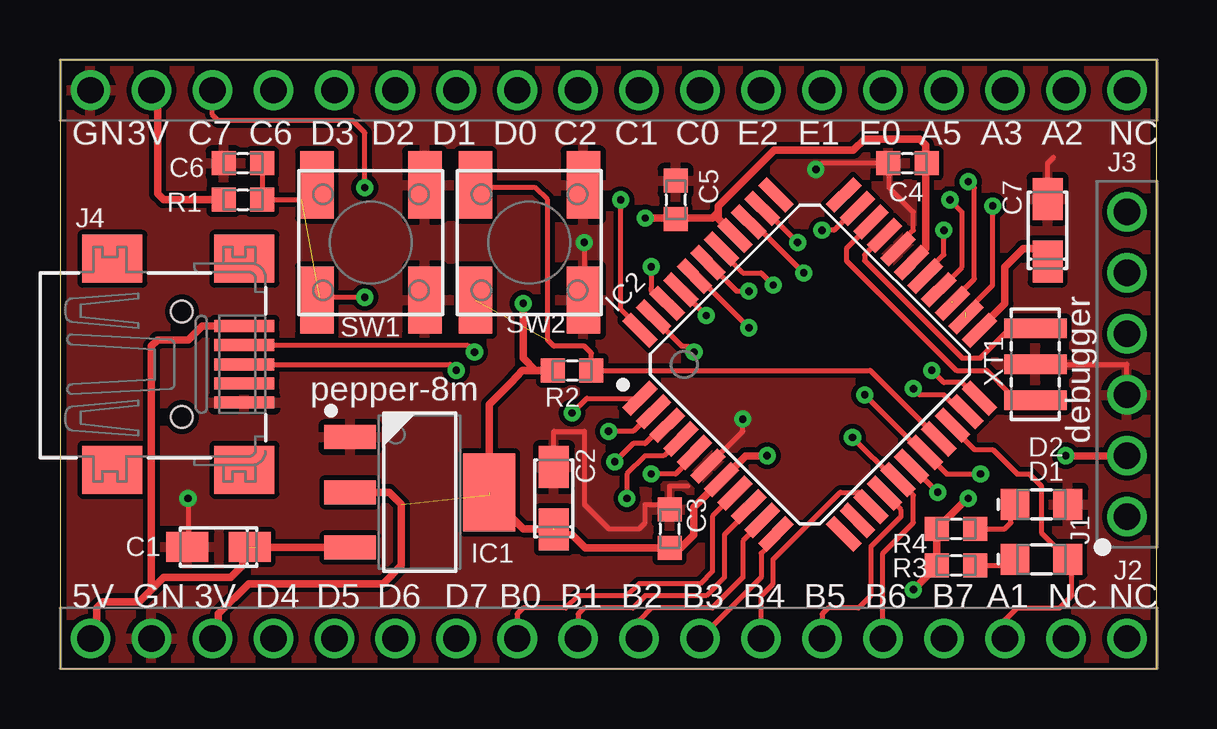
[diagram p1: board, top side]
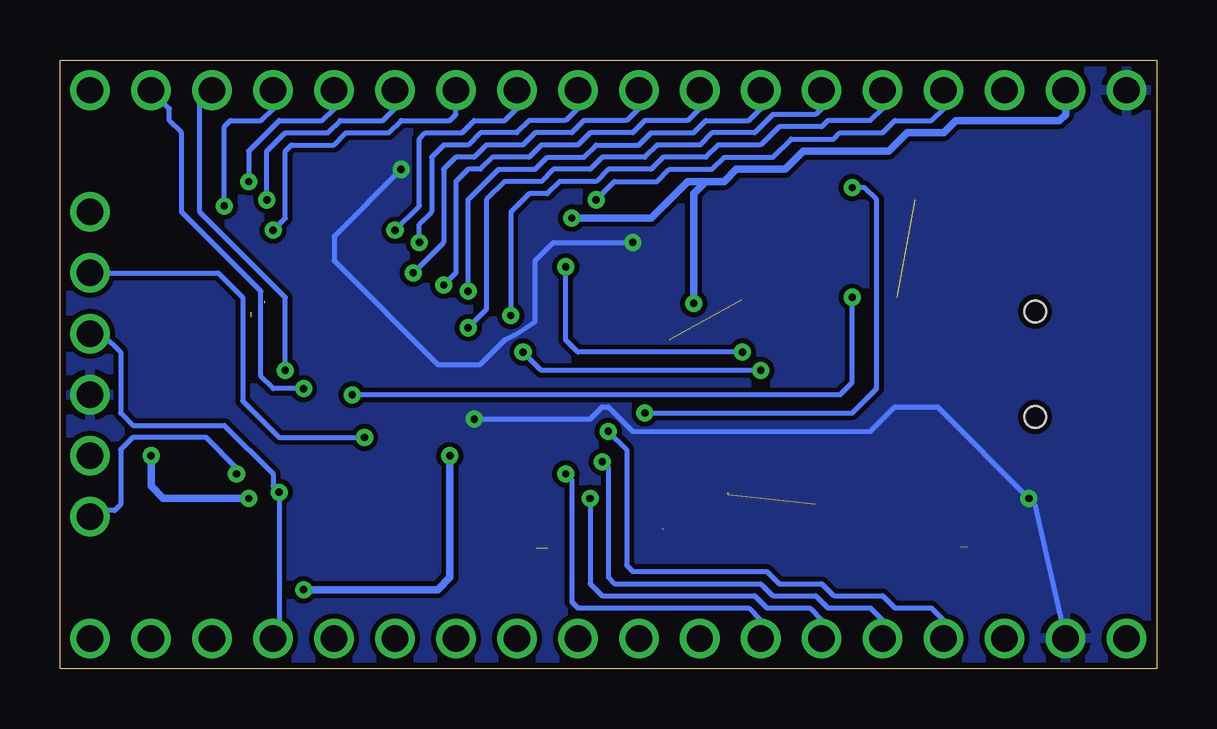
[diagram p2: board, bottom side, seen from below]

Size 45.71 x 25.39 mm. Coordinates in mm from the lower left corner, seen from the top.
Outline: 0,0 45.71,0 45.71,25.39 0,25.39 0,0
Copper layers (1*16): Top 0.035mm / dielectric 1.5mm / Bottom 0.035mm
Design rules "default": minimum track width 8mil, minimum drill 12mil, track to track 8mil, track to pad 8mil, pad to pad 8mil, via to via 8mil, smd to smd 8mil, copper to edge 10mil, drill to drill 8mil, minimum pad ring 10mil, minimum via ring 8mil, stop-mask expansion 4mil, vias tented up to drill 0mil, thermal gap 10mil

### Footprints (pad centres in the part's own frame; a part is rotated, then mirrored left to right if it is on the bottom)
CAPMP3216-18 = smd 1.75 x 1.25: 1 1.3,0; 2 -1.3,0
CAPC0603 = smd 1 x 1: 1 0.8,0; 2 -0.8,0
D0805 = smd 1.2 x 1.3: 1 1.1,0; 2 -1.1,0
SOT230P700X180-4N = smd 2.15 x 1: 1 -2.9,2.3; 2 -2.9,0; 3 -2.9,-2.3 | smd 2.15 x 3.25: 4 2.9,0
TQFP80P1200X1200X100-44N = smd 1.6 x 0.5: 1 -6,4; 2 -6,3.2; 3 -6,2.4; 4 -6,1.6; 5 -6,0.8; 6 -6,0; 7 -6,-0.8; 8 -6,-1.6; 9 -6,-2.4; 10 -6,-3.2; 11 -6,-4; 23 6,-4; 24 6,-3.2; 25 6,-2.4; 26 6,-1.6; 27 6,-0.8; 28 6,0; 29 6,0.8; 30 6,1.6; 31 6,2.4; 32 6,3.2; 33 6,4 | smd 0.5 x 1.6: 12 -4,-6; 13 -3.2,-6; 14 -2.4,-6; 15 -1.6,-6; 16 -0.8,-6; 17 0,-6; 18 0.8,-6; 19 1.6,-6; 20 2.4,-6; 21 3.2,-6; 22 4,-6; 34 4,6; 35 3.2,6; 36 2.4,6; 37 1.6,6; 38 0.8,6; 39 0,6; 40 -0.8,6; 41 -1.6,6; 42 -2.4,6; 43 -3.2,6; 44 -4,6
PHSP254P1524X254X1154-6S = drill 1.1: 1 0,0; 2 2.54,0; 3 5.08,0; 4 7.62,0; 5 10.16,0; 6 12.7,0
PHSP254P4572X254X1154-18S = drill 1.1: 1 0,0; 2 2.54,0; 3 5.08,0; 4 7.62,0; 5 10.16,0; 6 12.7,0; 7 15.24,0; 8 17.78,0; 9 20.32,0; 10 22.86,0; 11 25.4,0; 12 27.94,0; 13 30.48,0; 14 33.02,0; 15 35.56,0; 16 38.1,0; 17 40.64,0; 18 43.18,0
USB-MINIB-SMD+SMD+RET = smd 2.5 x 0.5: 1 2.6,1.6; 2 2.6,0.8; 3 2.6,0; 4 2.6,-0.8; 5 2.6,-1.6 | smd 2.5 x 2: 6 2.6,4.4; 7 -2.9,4.4; 8 2.6,-4.4; 9 -2.9,-4.4 | hole 0.9: 0,2.2; 0,-2.2
RESC0603 = smd 1 x 1: P$1 0.8,0; P$2 -0.8,0
TACT600X600-4J = smd 1.4 x 2.8: 1 2.25,-2.4; 2 2.25,2.4; 3 -2.25,-2.4; 4 -2.25,2.4
CERAMIC460X200-3N = smd 0.8 x 2.6: 1 -1.5,0; 2 0,0; 3 1.5,0

### Placement (x,y rotation side)
C1  6.6,5.08 0 top
C2  20.57,7.11 270 top
C3  25.4,5.84 270 top
C4  35.31,21.08 0 top
C5  25.65,19.56 270 top
C6  7.62,21.08 0 top
C7  41.15,18.29 270 top
D1  40.89,4.57 180 top
D2  40.89,6.86 180 top
IC1  14.99,7.37 0 top
IC2  31.24,12.7 45 top
J1  44.45,6.35 90 top
J2  44.45,1.27 180 top
J3  44.45,24.13 180 top
J4  5.08,12.7 0 top
R1  7.62,19.56 0 top
R2  21.34,12.45 0 top
R3  37.34,4.32 0 top
R4  37.34,5.84 0 top
SW1  12.95,17.78 0 top
SW2  19.56,17.78 0 top
XT1  40.64,12.7 90 top

### Tracks (layer width: path | path; a pad name or v marks a point on that pad's centre or on a via)
+3V3  (via drill 0.3)  (4 unrouted)
  Top 0.203: IC2.28 36.07,17.53 | C5.1 25.44,18.76 25.4,18.8
  Top 0.254: R4.P$2 R3.P$2
  Top 0.305: 17.89,7.26 19.3,5.84 20.07,5.84 | 20.07,5.84 20.6,5.84 | v29.46,8.89 28.56,8.89 IC2.7 26.42,6.74 26.42,5.59 25.87,5.04 21.88,5.04 21.34,5.59 20.32,5.59 20.07,5.84 | IC1.4 17.89,11.03 18.8,11.94 19.27,12.45 19.81,12.45 | IC1.2 13.72,7.37 14.22,6.86 14.22,4.32 13.46,3.56 7.87,3.56 6.6,2.29 6.6,1.52 J2.16 | IC2.37 27.43,18.77 27.43,19.05 | 27.43,19.05 27.43,19.3 29.76,21.63 33.06,21.63 33.53,22.1 35.81,22.1 36.07,21.84 36.07,21.12 C4.1 36.07,21.04 36.07,17.53 | v24.38,18.8 25.4,18.8 27.18,18.8 27.43,19.05 | 19.81,12.45 R2.P$2 | R1.P$2 4.32,19.56 4.06,19.81 4.06,23.88 J3.17 | v35.56,3.3 36.54,4.28 R4.P$2 37.81,7.11 v37.85,7.11 | J1.2 v41.91,8.89 | v19.3,15.24 19.3,12.95 19.81,12.45
  Bottom 0.305: v24.38,18.8 21.08,18.8 19.56,20.32 18.8,20.32 | J3.17 3.81,23.11 4.06,22.86 8.38,22.86 8.89,22.35 10.41,22.35 11.18,21.59 14.73,21.59 15.49,20.83 17.53,20.83 18.03,20.32 18.8,20.32 | v41.91,8.89 41.91,7.62 41.4,7.11 v37.85,7.11 | v29.46,8.89 29.46,3.81 29.97,3.3 v35.56,3.3 | v19.3,15.24 19.3,19.81 18.8,20.32
+5V  (1 unrouted)
  Top 0.305: J4.1 5.92,14.3 5.33,13.72 4.06,13.72 3.81,13.46 3.81,3.3 | 8.17,5.07 IC1.3 | C1.1 7.62,4.8 7.62,4.32 7.11,3.81 4.32,3.81 3.81,3.3 | 3.81,3.3 3.3,2.79 1.78,2.79 1.52,2.54 1.52,1.52 J2.18
A2  (via drill 0.3)
  Top 0.203: v35.56,11.68 35.81,11.43 36.83,11.43 37.54,10.72 IC2.21
  Bottom 0.203: v35.56,11.68 36.83,11.68 37.34,12.19 37.34,15.75 40.64,19.05 40.64,22.35 41.15,22.86 41.15,23.37 J3.2
A3  (via drill 0.3)
  Top 0.203: v36.32,12.45 36.83,11.94 37.59,11.94 38.24,11.29 IC2.22
  Bottom 0.203: v36.32,12.45 36.32,15.49 39.88,19.05 39.88,23.62 J3.3
A5  (via drill 0.3)  (1 unrouted)
  Top 0.203: 37.75,14.89 38.86,16 v38.86,19.3
  Bottom 0.203: v38.86,19.3 38.86,22.61 38.61,22.86 37.34,22.86 36.83,23.37 J3.4
B0
  Top 0.203: IC2.8 28.13,7.3 27.18,6.35 27.18,4.06 26.67,3.56 24.13,3.56 23.62,3.05 21.59,3.05 21.08,2.54 19.3,2.54 19.05,2.29 J2.11
B1
  Top 0.203: IC2.9 28.7,6.6 27.69,5.59 27.69,3.81 26.92,3.05 24.38,3.05 23.88,2.54 21.84,2.54 21.59,2.29 J2.10
B2
  Top 0.203: IC2.10 29.26,6.15 28.45,5.33 28.45,3.81 27.18,2.54 24.64,2.54 24.13,2.03 J2.9
B3
  Top 0.203: IC2.11 29.83,5.44 29.21,4.83 29.21,3.81 J2.8
B4
  Top 0.203: J2.7 29.21,3.05 29.72,3.56 29.72,4.57 32.51,7.37 33.27,7.37 33.53,7.11 33.53,7.02 IC2.14
B5
  Top 0.203: IC2.15 35.05,6.63 35.05,6.35 33.78,5.08 33.78,3.05 33.27,2.54 32,2.54 31.75,2.29 J2.6
BTN  (1 unrouted)
  Top 0.203: IC2.19 33.76,12.45 R2.P$1 22.14,13.17 21.84,13.46 20.57,13.46 20.32,13.72 20.32,19.56 19.81,20.07 17.42,20.07 SW2.4 | 17.53,16.26 17.27,16 17.27,15.42 SW2.3
C0  (via drill 0.3)
  Top 0.203: v31.75,18.29 32.26,18.29 33.17,19.2 IC2.32
  Bottom 0.203: v31.75,18.29 30.73,19.3 30.73,22.1 30.48,22.35 28.96,22.35 28.45,22.86 27.18,22.86 26.67,23.37 J3.8
C1  (via drill 0.3)
  Top 0.203: v30.73,17.78 29.31,19.2 IC2.35
  Bottom 0.203: v30.73,17.78 30.73,18.54 30.23,19.05 30.23,21.34 29.72,21.84 28.7,21.84 28.19,22.35 26.67,22.35 26.16,22.86 24.64,22.86 24.13,23.37 J3.9
C2  (via drill 0.3)
  Top 0.203: v30.99,16.51 28.86,18.64 IC2.36
  Bottom 0.203: v30.99,16.51 29.72,17.78 29.72,20.83 29.21,21.34 28.45,21.34 27.94,21.84 26.42,21.84 25.91,22.35 24.38,22.35 23.88,22.86 22.1,22.86 21.59,23.37 J3.10
C6  (via drill 0.3)
  Top 0.203: v23.37,19.56 23.37,14.99 24.17,14.18 IC2.44
  Bottom 0.203: v23.37,19.56 22.61,20.32 20.83,20.32 20.32,20.83 18.54,20.83 18.03,21.34 16,21.34 15.24,22.1 13.46,22.1 13.21,22.35 11.43,22.35 10.92,22.86 9.4,22.86 8.89,23.37 J3.15
C7  (via drill 0.3)
  Top 0.203: v21.34,10.67 21.95,11.29 IC2.1 24.17,11.22 24.13,11.18 | v12.7,20.07 12.7,22.35 12.19,22.86 6.6,22.86 6.35,23.11 J3.16
  Bottom 0.203: v21.34,10.67 12.7,10.67 11.68,11.68 11.68,19.56 12.19,20.07 v12.7,20.07
D0  (via drill 0.3)
  Top 0.203: v29.72,16 29.21,16.51 28.45,16.51 27.57,17.39 IC2.38
  Bottom 0.203: v29.72,16 29.21,16.51 29.21,20.32 28.7,20.83 28.19,20.83 27.69,21.34 26.16,21.34 25.65,21.84 24.13,21.84 23.62,22.35 21.84,22.35 21.34,22.86 19.56,22.86 19.05,23.37 J3.11
D1  (via drill 0.3)
  Top 0.203: IC2.39 28.19,15.75 v28.7,15.75 | IC2.39 | IC2.39 26.92,17.02 | 27.18,16.76 IC2.39
  Bottom 0.203: v28.7,15.75 28.7,19.56 27.43,20.83 25.91,20.83 25.4,21.34 23.88,21.34 23.37,21.84 21.59,21.84 21.08,22.35 19.3,22.35 18.8,22.86 17.02,22.86 16.51,23.37 J3.12
D2  (via drill 0.3)
  Top 0.203: v28.7,14.22 26.55,16.38 IC2.40
  Bottom 0.203: v28.7,14.22 27.94,14.99 27.94,19.56 27.18,20.32 25.65,20.32 25.15,20.83 23.62,20.83 23.11,21.34 21.34,21.34 20.83,21.84 19.05,21.84 18.54,22.35 16.76,22.35 16,23.11 14.22,23.11 13.97,23.37 J3.13
D3  (via drill 0.3)
  Top 0.203: v26.92,14.73 25.87,15.79 IC2.41
  Bottom 0.203: J3.14 11.43,23.37 11.94,22.86 13.72,22.86 13.97,22.61 15.75,22.61 16.51,21.84 18.29,21.84 18.8,21.34 20.57,21.34 21.08,20.83 22.86,20.83 23.37,20.32 24.89,20.32 25.4,19.81 26.16,19.81 26.92,19.05 v26.92,14.73
D4  (via drill 0.3)
  Top 0.203: 24.69,10.72 24.66,10.66 | IC2.2 24.72,10.72 24.66,10.66 | 24.66,10.66 24.63,10.66 23.88,9.91 v22.86,9.91
  Bottom 0.203: v22.86,9.91 22.1,9.14 22.1,4.32 21.84,4.06 16.26,4.06 15.75,3.56 13.97,3.56 13.46,3.05 11.43,3.05 10.92,2.54 9.4,2.54 8.89,2.03 J2.15
D5  (via drill 0.3)
  Top 0.203: v23.11,8.64 23.88,9.4 24.38,9.4 25.14,10.15 IC2.3
  Bottom 0.203: v23.11,8.64 22.86,8.38 22.86,3.81 22.61,3.56 16.51,3.56 16,3.05 14.22,3.05 13.72,2.54 11.94,2.54 11.43,2.03 J2.14
D6  (via drill 0.3)
  Top 0.203: v23.62,7.11 23.62,8.13 24.38,8.89 25.15,8.89 25.84,9.59 IC2.4
  Bottom 0.203: v23.62,7.11 23.62,3.56 23.11,3.05 16.76,3.05 16.26,2.54 14.48,2.54 13.97,2.03 J2.13
D7  (via drill 0.3)
  Top 0.203: v24.64,8.13 25.65,8.13 26.43,8.91 IC2.5
  Bottom 0.203: v24.64,8.13 24.38,7.87 24.38,2.79 24.13,2.54 17.02,2.54 16.51,2.03 J2.12
D+  (via drill 0.3)
  Top 0.203: J4.3 16.26,12.7 v16.51,12.45 | 26.16,13.26 26.16,13.21 v26.42,13.21 26.16,13.46 25.91,13.46 24.74,14.63 IC2.43
  Bottom 0.203: v16.51,12.45 25.65,12.45 v26.42,13.21
D-  (via drill 0.3)
  Top 0.203: J4.2 16.98,13.5 v17.27,13.21 | v24.64,16.76 24.64,16 24.64,15.91 24.64,15.75 25.14,15.25 IC2.42
  Bottom 0.203: v17.27,13.21 24.13,13.21 24.64,13.72 v24.64,16.76
E0  (via drill 0.3)  (1 unrouted)
  Top 0.203: 37.18,15.34 38.1,16.26 38.1,20.07 v37.85,20.32
  Bottom 0.203: J3.5 34.29,23.37 34.8,22.86 36.58,22.86 37.85,21.59 v37.85,20.32
E1  (via drill 0.3)
  Top 0.203: v37.08,19.56 37.59,19.05 37.59,16.76 36.64,15.81 IC2.26
  Bottom 0.203: J3.6 31.75,23.37 32.26,22.86 34.04,22.86 34.54,22.35 36.32,22.35 37.08,21.59 v37.08,19.56
E2  (via drill 0.3)
  Top 0.203: v36.83,18.29 36.83,17.27 36.05,16.49 IC2.27
  Bottom 0.203: v36.83,18.29 36.32,18.8 36.32,21.59 36.07,21.84 34.29,21.84 33.78,22.35 32,22.35 31.5,22.86 29.46,22.86 29.21,23.11 J3.7
EXTAL
  Top 0.203: IC2.30 34.33,18.07 33.53,17.27 33.53,17.02 37.59,12.95 38.35,12.95 39.62,14.22 40.62,14.22 XT1.3
GND  (via drill 0.3)
  Top 0.203: v5.33,7.11 5.33,5.3 | IC2.29 34.92,17.65 35.56,18.29 35.56,19.05 34.54,20.07 34.54,21.04 | 34.54,21.04 C4.2 | C2.2 20.57,9.91 21.84,9.91 21.84,6.86 22.86,5.84 24.13,5.84 24.38,6.1 24.38,6.86 25.15,6.86 25.4,6.6 25.4,7.62 26.16,7.62 | C7.2 41.15,21.08 41.4,21.34 | 34.54,21.04 34.54,21.08 31.75,21.08 v31.5,20.83 | v21.84,17.78 21.84,15.42 SW2.1 | XT1.2 44.45,12.7 J1.3 | IC2.6 28.45,9.91 v28.45,10.41
  Bottom 0.203: J2.17 5.08,6.86 v5.33,7.11 9.14,10.92 10.92,10.92 11.94,9.91 21.84,9.91 22.86,10.92 23.11,10.92 23.62,10.41 v28.45,10.41 | v31.5,20.83 34.29,18.03 34.29,17.02 29.97,12.7 28.19,12.7 27.18,13.72 26.67,13.97 25.91,14.48 25.91,17.02 25.15,17.78 v21.84,17.78
  pour Top: 0,25.4 45.72,25.4 45.72,0 0,0
  pour Bottom: 0,25.4 45.72,25.4 45.72,0 0,0
LED
  Top 0.203: J2.3 39.37,2.03 39.88,2.54 41.66,2.54 42.16,3.05 42.16,4.4 D1.2 40.89,5.67 40.89,7.62 40.39,8.13 39.88,8.13 38.86,9.14 38.1,9.14 37.18,10.06 IC2.20
N$1
  Top 0.203: R3.P$1 39.54,4.32 D1.1
N$2
  Top 0.305: IC2.23 38.31,14.18 39.37,15.24 39.37,16.76 40.13,17.53 41.12,17.53 41.15,17.3 C7.1
N$3
  Top 0.203: R4.P$1 39.37,5.84 39.62,6.1 39.62,6.69 D2.1
PGC  (via drill 0.3)
  Top 0.203: 35.03,7.89 IC2.16 | IC2.16 34.78,7.89 | J2.5 34.29,4.83 35.56,6.1 35.56,7.25 IC2.16 | 34.78,7.89 34.8,7.87 | 34.78,7.89 v33.02,9.65
  Bottom 0.203: J1.5 39.12,16.51 38.1,15.49 38.1,11.18 36.58,9.65 v33.02,9.65
PGD  (via drill 0.3)
  Top 0.203: IC2.17 | IC2.17 v36.58,7.37
  Bottom 0.203: J2.4 36.58,1.52 v36.58,7.37 36.83,7.62 36.83,8.13 38.86,10.16 42.67,10.16 43.18,10.67 43.18,13.21 43.94,13.97 J1.4
RESET  (via drill 0.3)  (1 unrouted)
  Top 0.203: 12.81,15.38 v12.7,15.49 10.82,15.49 SW1.3 | v33.53,11.43 35.94,9.02 IC2.18 36.95,8.13 v38.35,8.13 | C6.1 R1.P$1 10.08,19.56 SW1.4
  Bottom 0.203: v33.53,11.43 13.21,11.43 12.7,11.94 v12.7,15.49 | v38.35,8.13 38.35,8.38 39.62,9.65 42.67,9.65 43.18,9.14 43.18,6.86 43.43,6.6 44.2,6.6 J1.1
XTAL
  Top 0.203: IC2.31 33.79,18.55 32.77,17.53 32.77,17.02 37.34,12.45 38.61,12.45 39.62,11.43 40.41,11.43 XT1.1

### Text on the board
tPlace: GN | 3V | C7 | C6 | D3 | D2 | D1 | D0 | C2 | C1 | C0 | E2 | E1 | E0 | A5 | A3 | A2 | NC | pepper-8m | debugger | 5V | GN | 3V | D4 | D5 | D6 | D7 | B0 | B1 | B2 | B3 | B4 | B5 | B6 | B7 | A1 | NC | NC